# Altium project LSP_PCB_Project.PrjPCB
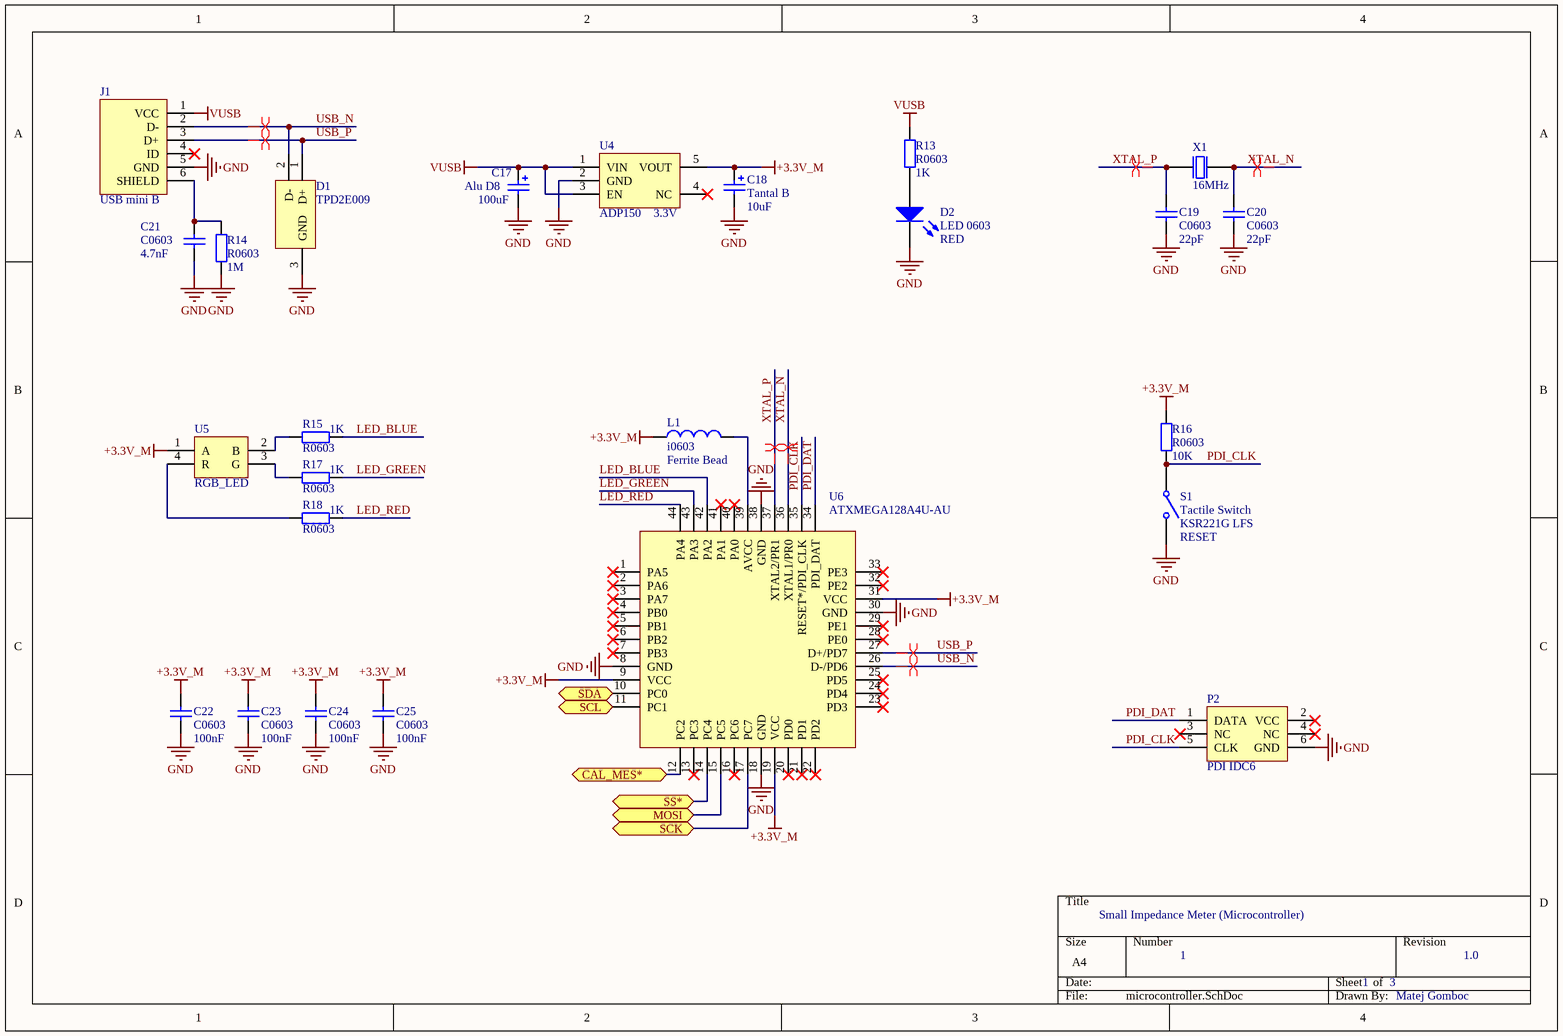
[diagram p0: microcontroller.SchDoc]
1 sheet, 25 parts. Net scope: flat (ports and power ports of the same name join across sheets).
Board file: PCB1.PcbDoc

## Sheet microcontroller.SchDoc: Small Impedance Meter (Microcontroller)
size A4; ApprovedBy: Matej Gomboc; CheckedBy: Matej Gomboc; Author: Matej Gomboc; DrawnBy: Matej Gomboc; Engineer: Matej Gomboc; DocumentNumber: 1; Revision: 1.0; SheetNumber: 1; SheetTotal: 3; DocumentName: Microcontroller; ProjectName: Small Impedance Meter

### Parts
C17  Alu D8  value 100uF  [PANASONIC SIZE D8]
C18  Tantal B  value 10uF  [AVX-CAPC3528_V]
C19  C0603  value 22pF  [0603_HandSoldering]
C20  C0603  value 22pF  [0603_HandSoldering]
C21  C0603  value 4.7nF  [0603_HandSoldering]
C22  C0603  value 100nF  [0603_HandSoldering]
C23  C0603  value 100nF  [0603_HandSoldering]
C24  C0603  value 100nF  [0603_HandSoldering]
C25  C0603  value 100nF  [0603_HandSoldering]
D1  TPD2E009  [TPD2E009_SOT23_3]
D2  LED 0603  value RED  [0603_LED]
J1  USB mini B  [USB mini B receptacle]
L1  i0603  value Ferrite Bead  [0603_HandSoldering]
P2  PDI IDC6  [PDI_HDR2X3]
R13  R0603  value 1K  [0603_HandSoldering]
R14  R0603  value 1M  [0603_HandSoldering]
R15  R0603  value 1K  [0603_HandSoldering]
R16  R0603  value 10K  [0603_HandSoldering]
R17  R0603  value 1K  [0603_HandSoldering]
R18  R0603  value 1K  [0603_HandSoldering]
S1  Tactile Switch  value KSR221G LFS  Note: RESET  [KSR221G_LFS_Tactile_Switch]
U4  ADP150  value 3.3V  [ADP150]
U5  RGB_LED  [PLCC-4_LED]
U6  ATXMEGA128A4U-AU  [ATXMEGAA4U_TQFP44]
X1  16MHz  [XTAL_TH_LOW]

### Ports
CAL_MES*, MOSI, SCK, SCL, SDA, SS*

### Nets
+3.3V_M: C18.1 C22.1 C23.1 C24.1 C25.1 L1.1 R16.2 U4.5(VOUT) U5.1(A) U6.9(VCC) U6.19(VCC) U6.31(VCC)
GND: C17.2 C18.2 C19.1 C20.1 C21.1 C22.2 C23.2 C24.2 C25.2 D1.3(GND) D2.2(K) J1.5(GND) P2.6(GND) R14.1 S1.2(NO) U4.2(GND) U6.8(GND) U6.18(GND) U6.30(GND) U6.38(GND)
VUSB: C17.1 J1.1(VCC) R13.1 U4.1(VIN) U4.3(EN)
LED_BLUE: R15.2 U6.42(PA2)
LED_GREEN: R17.1 U6.43(PA3)
LED_RED: R18.1 U6.44(PA4)
PDI_CLK: P2.5(CLK) R16.1 S1.1(COMMON) U6.35(RESET*/PDI_CLK)
PDI_DAT: P2.1(DATA) U6.34(PDI_DAT)
USB_N: D1.2(D-) J1.2(D-) U6.26(D-/PD6)
USB_P: D1.1(D+) J1.3(D+) U6.27(D+/PD7)
XTAL_N: C20.2 U6.36(XTAL1/PR0) X1.2(out)
XTAL_P: C19.2 U6.37(XTAL2/PR1) X1.1(inp)
NetC21_2: C21.2 J1.6(SHIELD) R14.2
NetD2_1: D2.1(A) R13.2
NetL1_2: L1.2 U6.39(AVCC)
NetR15_1: R15.1 U5.2(B)
NetR17_2: R17.2 U5.3(G)
NetR18_2: R18.2 U5.4(R)
NetU6_10: U6.10(PC0) ; port SDA
NetU6_11: U6.11(PC1) ; port SCL
NetU6_12: U6.12(PC2) ; port CAL_MES*
NetU6_14: U6.14(PC4) ; port SS*
NetU6_15: U6.15(PC5) ; port MOSI
NetU6_17: U6.17(PC7) ; port SCK

Not connected (* = marked no-connect by the designer): J1 4(ID)*; P2 2(VCC)* 3(NC)* 4(NC)*; U4 4(NC)*; U6 1(PA5)* 2(PA6)* 3(PA7)* 4(PB0)* 5(PB1)* 6(PB2)* 7(PB3)* 13(PC3)* 16(PC6)* 20(PD0)* 21(PD1)* 22(PD2)* 23(PD3)* 24(PD4)* 25(PD5)* 28(PE0)* 29(PE1)* 32(PE2)* 33(PE3)* 40(PA0)* 41(PA1)*

### Layout directives
differential pair: USB_N, USB_P, XTAL_N, XTAL_P

### Library data of the parts
C17 = Capacitor Aluminium: Aluminium Electrolythic Capacitor
C18 = Capacitor Tantalum: Tantalum Capacitor
C19-C25 = Capacitor: Ceramic Capacitor
D1 = TPD2E009: ESD protection
D2 = LED: SMD LED 0603
J1 = USB_mini_B: USB 2.0 mini B receptacle
L1 = Inductor
P2 = PDI_Header: PDI Programming Interface
R13-R18 = Resistor
S1 = SW-SPST: KSR221G LFS Tactile Switch
U4 = ADP150: 100 mA Voltage Regulator
U5 = RGB_LED: RGB LED ASMB-MTB0-0A3A2
U6 = ATXMEGA128A4U-AU: 8/16-bit Atmel XMEGA Microcontroller
X1 = XTAL_TH_LOW: XTAL TH Low Profile; Value: 16MHz